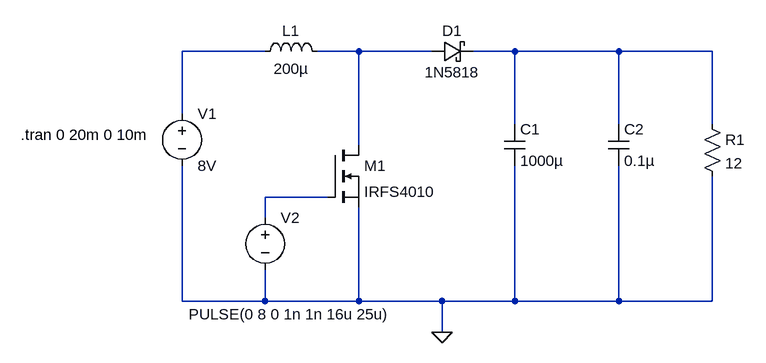
[diagram p0: schematic grad_project_1_no_esr_or_esl.asc]
grad_project_1_no_esr_or_esl.asc, the LTspice schematic file:
Version 4
SHEET 1 936 680
WIRE 192 32 64 32
WIRE 336 32 272 32
WIRE 448 32 336 32
WIRE 576 32 512 32
WIRE 736 32 576 32
WIRE 880 32 736 32
WIRE 64 128 64 32
WIRE 576 144 576 32
WIRE 736 144 736 32
WIRE 880 144 880 32
WIRE 336 176 336 32
WIRE 288 256 192 256
WIRE 192 288 192 256
WIRE 64 416 64 208
WIRE 192 416 192 368
WIRE 192 416 64 416
WIRE 336 416 336 272
WIRE 336 416 192 416
WIRE 464 416 336 416
WIRE 576 416 576 208
WIRE 576 416 464 416
WIRE 736 416 736 208
WIRE 736 416 576 416
WIRE 880 416 880 224
WIRE 880 416 736 416
WIRE 464 464 464 416
FLAG 464 464 0
SYMBOL voltage 64 112 R0
WINDOW 123 0 0 Left 0
WINDOW 39 0 0 Left 0
SYMATTR InstName V1
SYMATTR Value 8V
SYMBOL ind 176 48 R270
WINDOW 0 32 56 VTop 2
WINDOW 3 5 56 VBottom 2
SYMATTR InstName L1
SYMATTR Value 200µ
SYMBOL cap 560 144 R0
SYMATTR InstName C1
SYMATTR Value 1000µ
SYMBOL nmos 288 176 R0
SYMATTR InstName M1
SYMATTR Value IRFS4010
SYMBOL res 864 128 R0
SYMATTR InstName R1
SYMATTR Value 12
SYMBOL cap 720 144 R0
SYMATTR InstName C2
SYMATTR Value 0.1µ
SYMBOL schottky 448 48 R270
WINDOW 0 32 32 VTop 2
WINDOW 3 0 32 VBottom 2
SYMATTR InstName D1
SYMATTR Value 1N5818
SYMBOL voltage 192 272 R0
WINDOW 3 -118 164 Left 2
WINDOW 123 0 0 Left 0
WINDOW 39 0 0 Left 0
SYMATTR InstName V2
SYMATTR Value PULSE(0 8 0 1n 1n 16u 25u)
TEXT -184 160 Left 2 !.tran 0 20m 0 10m

The netlist it stands for:
* grad_project_1_no_esr_or_esl.asc
V1 N001 0 8V
L1 N001 N002 200µ
C1 N003 0 1000µ
M1 N002 N004 0 0 IRFS4010
R1 N003 0 12
C2 N003 0 0.1µ
D1 N002 N003 1N5818
V2 N004 0 PULSE(0 8 0 1n 1n 16u 25u)
.model D D
.lib standard.dio
.model NMOS NMOS
.model PMOS PMOS
.lib standard.mos
.tran 0 20m 0 10m
.backanno
.end